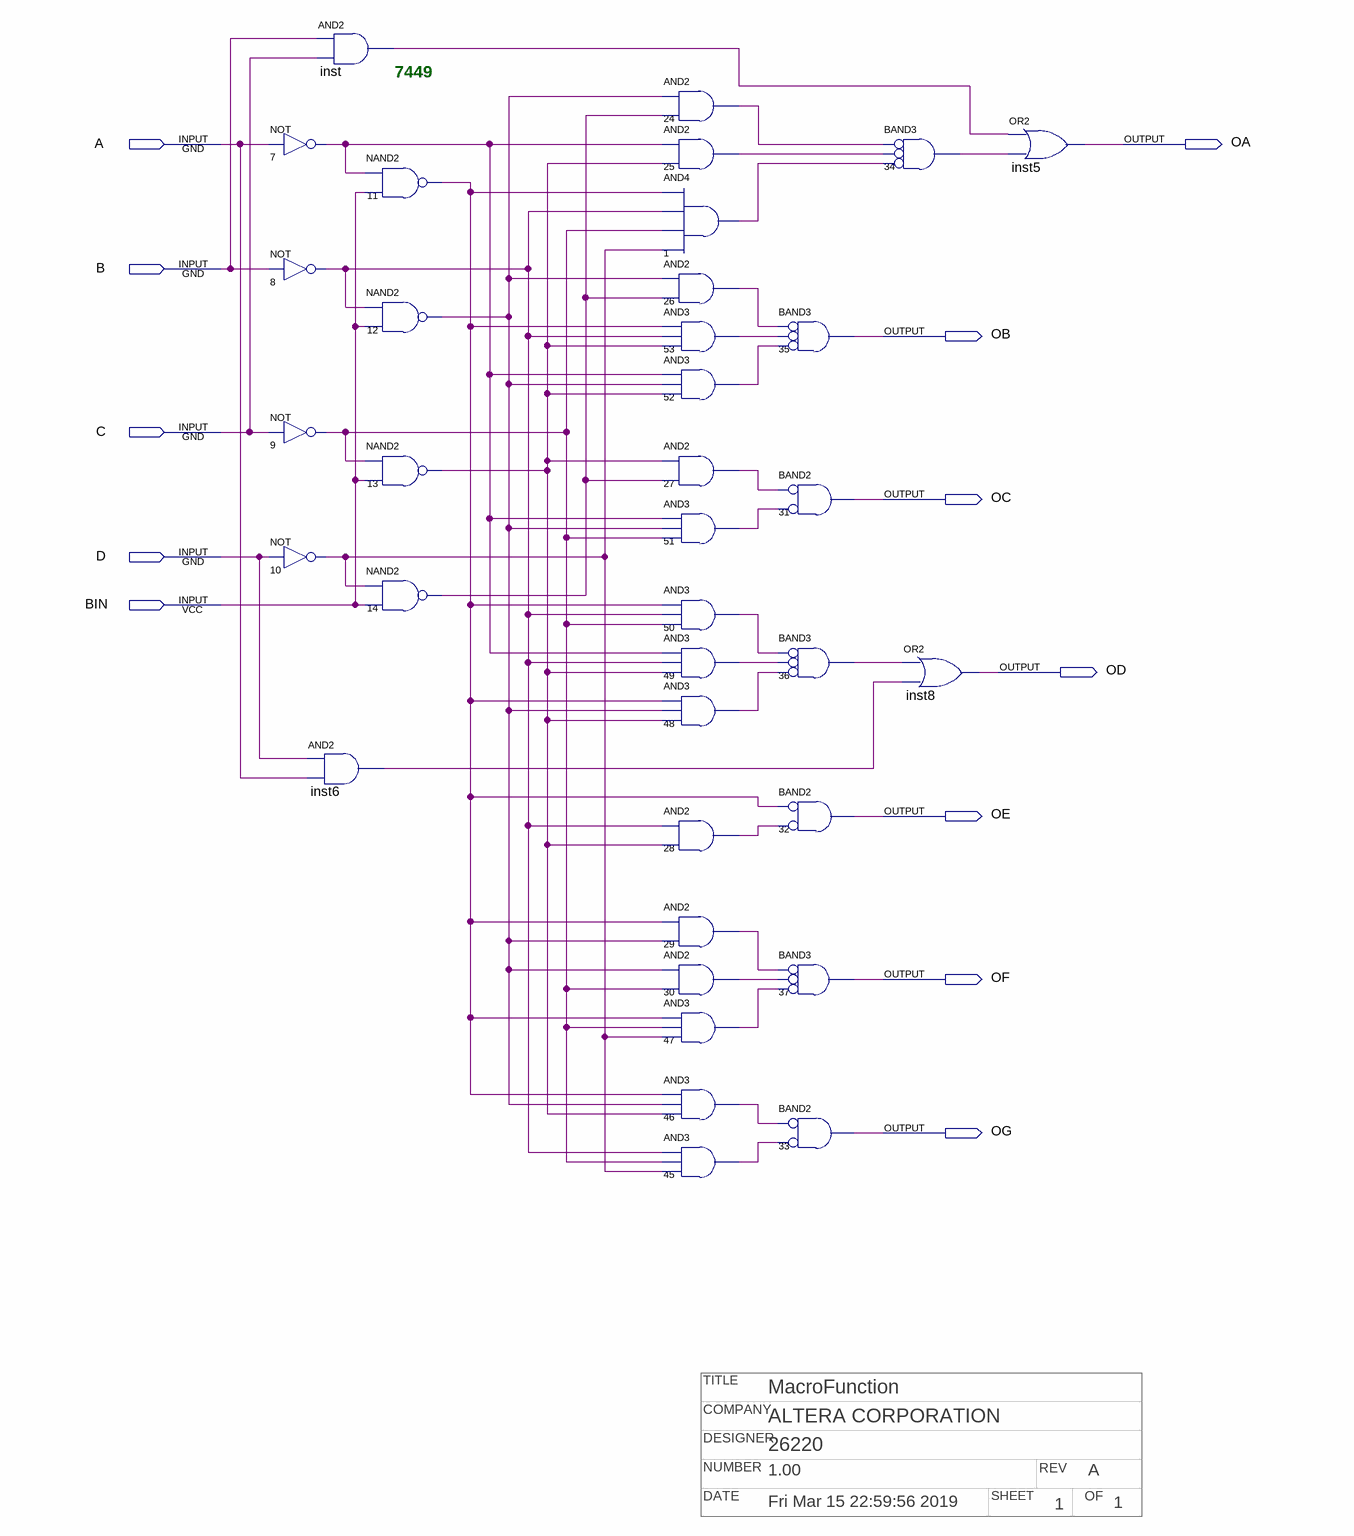
[diagram p0: schematic sheet]
// Quartus schematic ex7449.bdf as structural Verilog: 36 symbols, 12 pins
// Title block: TITLE: MacroFunction; COMPANY: ALTERA CORPORATION; DESIGNER: 26220; NUMBER: 1.00; REV: A; DATE: Fri Mar 15 22:59:56 2019; SHEET: 1; OF: 1
module ex7449 (
  input  A,
  input  B,
  input  C,
  input  D,
  input  BIN,
  output OA,
  output OB,
  output OC,
  output OD,
  output OE,
  output OF,
  output OG
);

  wire inst6_out, inst_out, n1_out, n7_out, n8_out, n9_out, n10_out, n11_out, n12_out, n13_out, n14_out,
       n24_out, n25_out, n26_out, n27_out, n28_out, n29_out, n30_out, n34_out, n36_out, n45_out, n46_out,
       n47_out, n48_out, n49_out, n50_out, n51_out, n52_out, n53_out;

  and inst (inst_out, B, C);
  not u_7 (n7_out, A);
  not u_8 (n8_out, B);
  not u_9 (n9_out, C);
  not u_10 (n10_out, D);
  and inst6 (inst6_out, D, A);
  nand u_11 (n11_out, n7_out, BIN);
  nand u_12 (n12_out, n8_out, BIN);
  nand u_13 (n13_out, n9_out, BIN);
  nand u_14 (n14_out, n10_out, BIN);
  and u_24 (n24_out, n12_out, n14_out);
  and u_25 (n25_out, n7_out, n13_out);
  and u_1 (n1_out, n11_out, n8_out, n9_out, n10_out);
  and u_26 (n26_out, n12_out, n14_out);
  and u_53 (n53_out, n11_out, n8_out, n13_out);
  and u_52 (n52_out, n7_out, n12_out, n13_out);
  and u_27 (n27_out, n13_out, n14_out);
  and u_51 (n51_out, n7_out, n12_out, n9_out);
  and u_50 (n50_out, n11_out, n8_out, n9_out);
  and u_49 (n49_out, n7_out, n8_out, n13_out);
  and u_48 (n48_out, n11_out, n12_out, n13_out);
  and u_28 (n28_out, n8_out, n13_out);
  and u_29 (n29_out, n11_out, n12_out);
  and u_30 (n30_out, n12_out, n9_out);
  and u_47 (n47_out, n11_out, n9_out, n10_out);
  and u_46 (n46_out, n11_out, n12_out, n13_out);
  and u_45 (n45_out, n8_out, n9_out, n10_out);
  and u_35 (OB, ~n26_out, ~n53_out, ~n52_out);  // BAND3
  and u_31 (OC, ~n27_out, ~n51_out);  // BAND2
  and u_36 (n36_out, ~n50_out, ~n49_out, ~n48_out);  // BAND3
  and u_32 (OE, ~n11_out, ~n28_out);  // BAND2
  and u_37 (OF, ~n29_out, ~n30_out, ~n47_out);  // BAND3
  and u_33 (OG, ~n46_out, ~n45_out);  // BAND2
  and u_34 (n34_out, ~n24_out, ~n25_out, ~n1_out);  // BAND3
  or inst8 (OD, n36_out, inst6_out);
  or inst5 (OA, inst_out, n34_out);

  // Notes on the sheet:
  //   7449
endmodule
